# EAGLE schematic DeviceDummy (EAGLE 5.00)
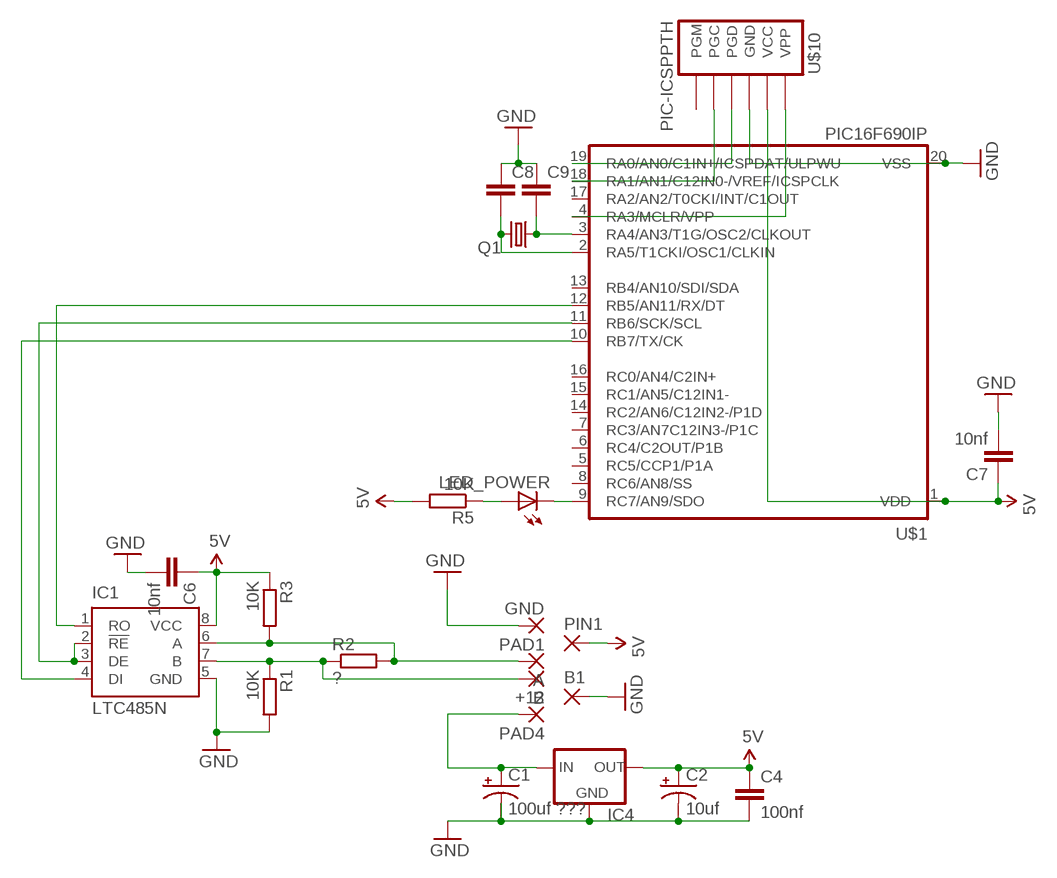
[diagram p0: schematic, sheet 1]

## Parts
A  2,15/1,0  [2,15/1,0]
B  2,15/1,0  [2,15/1,0]
B1  2,15/1,0  [2,15/1,0]
C1  100uf ???  CAP_POLPTH1  [CPOL-RADIAL-100UF-25V]
C2  10uf  CAP_POLPTH1  [CPOL-RADIAL-100UF-25V]
C4  100nf  C2.5/2  [C2.5-2]
C6  10nf  C2.5/2  [C2.5-2]
C7  10nf  C2.5/2  [C2.5-2]
C8  C2.5/2  [C2.5-2]
C9  C2.5/2  [C2.5-2]
IC1  LTC485N  [DIL08]
IC4  78XXS  [78XXS]
LED_POWER  LED5MM  [LED5MM]
PAD1  GND  2,15/1,0  [2,15/1,0]
PAD4  +12  2,15/1,0  [2,15/1,0]
PIN1  2,15/1,0  [2,15/1,0]
Q1  CRYSTALHC49S  [HC49/S]
R1  10K  R-EU_0204/5  [0204/5]
R2  ?  R-EU_0207/2V  [0207/2V]
R3  10K  R-EU_0204/5  [0204/5]
R5  10K  R-EU_0207/2V  [0207/2V]
U$1  PIC16F690IP  [DIL20]
U$10  PIC-ICSPPTH  [MOLEX-1X6]

## Nets
5V: C2.1(+) C4.1 C6.1 C7.1 IC1.8(VCC) IC4.OUT PIN1.1(P) R3.1 R5.2 U$1.1(VDD) U$10.5(VCC)
GND: B1.1(P) C1.2(-) C2.2(-) C4.2 C6.2 C7.2 C8.1 C9.1 IC1.5(GND) IC4.GND PAD1.1(P) R1.2 U$1.20(VSS) U$10.4(GND)
N$1: U$1.4(RA3/MCLR/VPP) U$10.6(VPP)
N$3: A.1(P) IC1.6(A) R2.2 R3.2
N$4: U$1.18(RA1/AN1/C12IN0-/VREF/ICSPCLK) U$10.2(PGC)
N$6: U$1.19(RA0/AN0/C1IN+/ICSPDAT/ULPWU) U$10.3(PGD)
N$25: IC1.2(!RE) IC1.3(DE) U$1.11(RB6/SCK/SCL)
N$41: LED_POWER.K(C) U$1.9(RC7/AN9/SDO)
N$42: LED_POWER.A R5.1
N$46: C1.1(+) IC4.IN PAD4.1(P)
N$49: IC1.4(DI) U$1.10(RB7/TX/CK)
N$50: B.1(P) IC1.7(B) R1.1 R2.1
N$51: IC1.1(RO) U$1.12(RB5/AN11/RX/DT)
N$52: C8.2 Q1.2 U$1.2(RA5/T1CKI/OSC1/CLKIN)
N$53: C9.2 Q1.1 U$1.3(RA4/AN3/T1G/OSC2/CLKOUT)
Unconnected: U$1.5(RC5/CCP1/P1A) U$1.6(RC4/C2OUT/P1B) U$1.7(RC3/AN7C12IN3-/P1C) U$1.8(RC6/AN8/SS) U$1.13(RB4/AN10/SDI/SDA) U$1.14(RC2/AN6/C12IN2-/P1D) U$1.15(RC1/AN5/C12IN1-) U$1.16(RC0/AN4/C2IN+) U$1.17(RA2/AN2/T0CKI/INT/C1OUT) U$10.1(PGM)

## Library data of the parts
A B B1 PAD1 PAD4 PIN1 = wirepad:2,15/1,0: THROUGH-HOLE PAD
C1 C2 = SparkFun:CAP_POL: Capacitor Polarized These are standard SMD and PTH capacitors. Normally 10uF, 47uF, and 100uF in electrolytic and tantalum varieties. Always verify the external diameter of the through hole cap, it varies with capacity, voltage, and manufacturer. The EIA devices should be standard.
C4 C6-C9 = capacitor-wima:C: CAPACITOR naming: grid - package width
IC1 = linear-technology:LTC485: Low Power RS485 Interface Transceiver Source: http://www.linear.com/pc/downloadDocument.do?navId=H0,C1,C1007,C1017,P2064,D1718
IC4 = v-reg:78XXS: VOLTAGE REGULATOR
LED_POWER = led:LED: LED OSRAM: - CHIPLED LG R971, LG N971, LY N971, LG Q971, LY Q971, LO R971, LY R971 LH N974, LH R974 LS Q976, LO Q976, LY Q976 LO Q996 - Hyper CHIPLED LW Q18S LB Q993, LB Q99A, LB R99A - SideLED LS A670, LO A670, LY A670, LG A670, LP A670 LB A673, LV A673, LT A673, LW A673 LH A674 LY A675 LS A676, LA A676, LO A676, LY A676, LW A676 LS A679, LY A679, LG A679 - Hyper Micro SIDELED® LS Y876, LA Y876, LO Y876, LY Y876 LT Y87S - SmartLED LW L88C, LW L88S LB L89C, LB L89S, LG L890 LS L89K, LO L89K, LY L89K LS L896, LA L896, LO L896, LY L896 - TOPLED LS T670, LO T670, LY T670, LG T670, LP T670 LSG T670, LSP T670, LSY T670, LOP T670, LYG T670 LG T671, LOG T671, LSG T671 LB T673, LV T673, LT T673, LW T673 LH T674 LS T676, LA T676, LO T676, LY T676, LB T676, LH T676, LSB T676, LW T676 LB T67C, LV T67C, LT T67C, LS T67K, LO T67K, LY T67K, LW E67C LS E67B, LA E67B, LO E67B, LY E67B, LB E67C, LV E67C, LT E67C LW T67C LS T679, LY T679, LG T679 LS T770, LO T770, LY T770, LG T770, LP T770 LB T773, LV T773, LT T773, LW T773 LH T774 LS E675, LA E675, LY E675, LS T675 LS T776, LA T776, LO T776, LY T776, LB T776 LHGB T686 LT T68C, LB T68C - Hyper Mini TOPLED® LB M676 - Mini TOPLED Santana® LG M470 LS M47K, LO M47K, LY M47K Source: http://www.osram.convergy.de LUXEON: - LUMILED® LXK2-PW12-R00, LXK2-PW12-S00, LXK2-PW14-U00, LXK2-PW14-V00 LXK2-PM12-R00, LXK2-PM12-S00, LXK2-PM14-U00 LXK2-PE12-Q00, LXK2-PE12-R00, LXK2-PE12-S00, LXK2-PE14-T00, LXK2-PE14-U00 LXK2-PB12-K00, LXK2-PB12-L00, LXK2-PB12-M00, LXK2-PB14-N00, LXK2-PB14-P00, LXK2-PB14-Q00 LXK2-PR12-L00, LXK2-PR12-M00, LXK2-PR14-Q00, LXK2-PR14-R00 LXK2-PD12-Q00, LXK2-PD12-R00, LXK2-PD12-S00 LXK2-PH12-R00, LXK2-PH12-S00 LXK2-PL12-P00, LXK2-PL12-Q00, LXK2-PL12-R00 Source: www.luxeon.com KINGBRIGHT: KA-3528ASYC Source: www.kingbright.com
Q1 = crystal:CRYSTAL: CRYSTAL
R1 R3 = resistor:R-EU_: RESISTOR, European symbol
R2 R5 = rcl:R-EU_: RESISTOR, European symbol
U$1 = microchip-5:PIC16F690*: MICROCONTROLLER PIC16F690 18 I/O One 16-bit timer Two 8-bit timer Two comparators Precision internal oscillator-software selectable 8 MHz - 32 KHz SSP w/ I2C Compatible Address mask option EUSART LIN 2.0 Compatible ECCP+ w/ PWM Steering 12 A/D Channels ULPW Enhanced Low Power Timer 1 Timer 1 Gate Synch Latch 4k Program Flash memory 256 bytes SRAM 256 bytes EEPROM
U$10 = SparkFun:PIC-ICSP: ISCP Programming connector for UAV, UBW Kit, etc.